# EasyEDA Pro project 底板.epro

# Schematic Schematic1
Assembly Variant: Basic; Board Name: Board1; Create Date: 2026-09-26; Page Name: P1; Project Name: 底板; Schematic Name: Schematic1; Update Date: 2026-09-26; Company: 嘉立创EDA; Page Size: A4; Version: V1.0
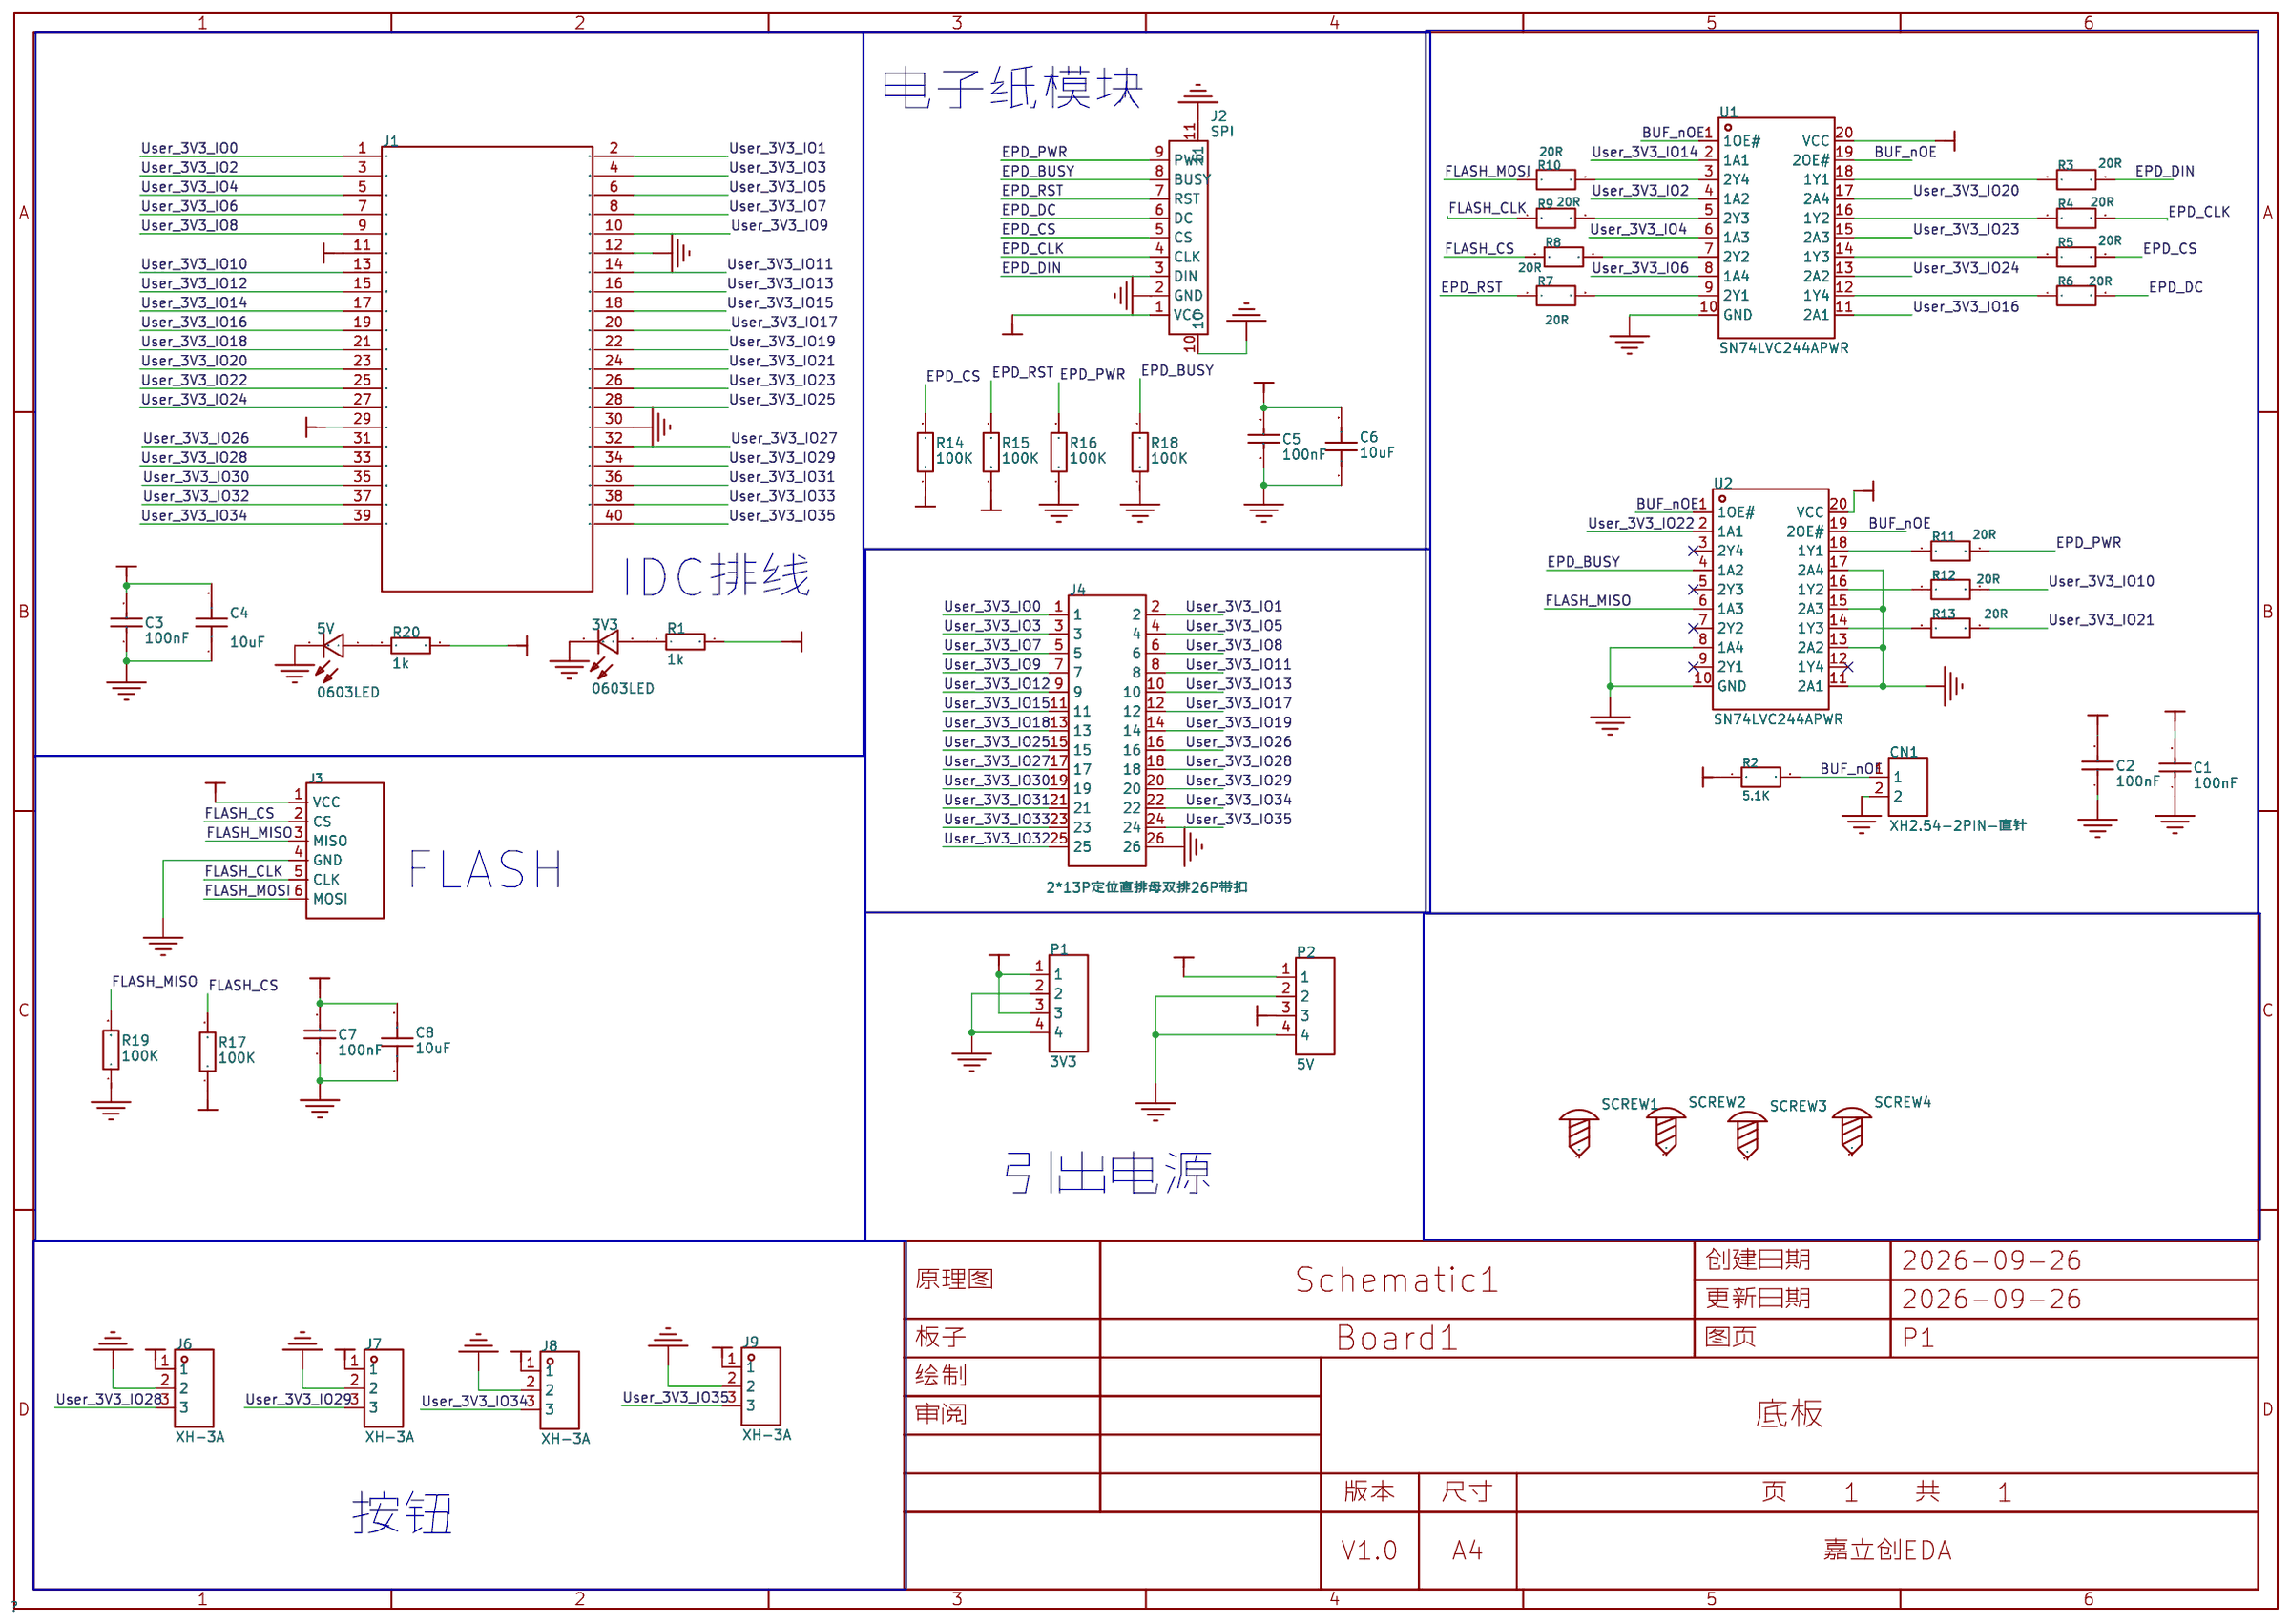
[diagram p0: schematic sheet]

## Parts
3V3  0603LED  [LED0603-R-RD_RED]
5V  0603LED  [LED0603-R-RD_RED]
C1  100nF  [C0603]
C2  100nF  [C0603]
C3  100nF  [C0603]
C4  10uF  [C0805]
C5  100nF  [C0603]
C6  10uF  [C0805]
C7  100nF  [C0603]
C8  10uF  [C0805]
CN1  XH2.54-2PIN-直针  [CONN-TH_XH2.54-2P]
J1  -  [IDC40P]
J2  SPI  [CONN-SMD_9P-P1.25_BX-GH1.25-9PWT]
J3  X4611FV-06-C63D28  [HDR-TH_6P-P2.00-V-F]
J4  2*13P定位直排母双排26P带扣  [IDC-TH_26P-P2.54-V-M-R2-C13-S2.54]
J6  XH-3A  [CONN-TH_3P-P2.50_C9900023074]
J7  XH-3A  [CONN-TH_3P-P2.50_C9900023074]
J8  XH-3A  [CONN-TH_3P-P2.50_C9900023074]
J9  XH-3A  [CONN-TH_3P-P2.50_C9900023074]
P1  3V3  [CONN-TH_4P-P2.50-XH2.54-4P]
P2  5V  [CONN-TH_4P-P2.50-XH2.54-4P]
R1  1k  [R0603]
R2  5.1K  [R0603]
R3  20R  [R0603]
R4  20R  [R0603]
R5  20R  [R0603]
R6  20R  [R0603]
R7  20R  [R0603]
R8  20R  [R0603]
R9  20R  [R0603]
R10  20R  [R0603]
R11  20R  [R0603]
R12  20R  [R0603]
R13  20R  [R0603]
R14  100K  [R0805]
R15  100K  [R0805]
R16  100K  [R0805]
R17  100K  [R0805]
R18  100K  [R0805]
R19  100K  [R0805]
R20  1k  [R0603]
SCREW1  -  [M3螺丝]
SCREW2  -  [M3螺丝]
SCREW3  -  [M3螺丝]
SCREW4  -  [M3螺丝]
U1  SN74LVC244APWR  [TSSOP-20_L6.5-W4.4-P0.65-LS6.4-BL]
U2  SN74LVC244APWR  [TSSOP-20_L6.5-W4.4-P0.65-LS6.4-BL]

## Library data of the parts
3V3 5V = 0603LED: Supplier Part: C9900009051; Supplier Footprint: LED-RED-0603; JLCPCB Part Class: Extended Part; Supplier: LCSC
C1-C3 C5 C7 = CL10A225KO8NNNC: 容值:2.2uF;精度:±10%;额定电压:16V;温度系数:X5R;; LCSC Part Name: 2.2uF ±10% 16V; Supplier Part: C23630; Manufacturer: SAMSUNG(三星); Supplier Footprint: 0603; JLCPCB Part Class: Basic Part; Datasheet: https://item.szlcsc.com/datasheet/CL10A225KO8NNNC/24366.html; Supplier: LCSC; Tolerance: ±10%; Voltage Rating: 16V; Temperature Coefficient: X5R
C4 C6 C8 = GRM21BR61H106KE43L: 容值:10uF;精度:±10%;额定电压:50V;温度系数:X5R;; LCSC Part Name: 10uF ±10% 50V; Supplier Part: C440198; Manufacturer: muRata(村田); Supplier Footprint: 0805; JLCPCB Part Class: Basic Part; Datasheet: https://item.szlcsc.com/datasheet/GRM21BR61H106KE43L/439567.html; Supplier: LCSC; Tolerance: ±10%; Voltage Rating: 50V; Temperature Coefficient: X5R
CN1 = XH2.54-2PIN-直针: Supplier Part: C9900011425; Supplier Footprint: XH2.54-2PIN; JLCPCB Part Class: Extended Part; Supplier: LCSC
J1 = iDC40P
J2 = BX-GH1.25-9PWT: 插针结构:1x9P;间距:1.25mm;安装方式:卧贴;参考系列:GH;总PIN数:9P;排数:1;每排PIN数:9;行距:-;额定电流:1A;触头材质:磷铜;触头镀层:锡;工作温度:-25℃~+85℃;; LCSC Part Name: 1x9P 间距:1.25mm 卧贴 系列:GH; Supplier Part: C18077725; Manufacturer: Bossie(博锡); Supplier Footprint: SMD,P=1.25mm,卧贴; JLCPCB Part Class: Extended Part; Datasheet: https://item.szlcsc.com/datasheet/BX-GH1.25-9PWT/19218126.html; Supplier: LCSC; Pins Structure: 1x9P; Pitch: 1.25mm; Mounting Type: 卧贴; Reference Series: GH; Number of Pins: 9P; Number of Rows: 1; Number of PINs Per Row: 9; Current Rating: 1A; Contact Material: 磷铜; Contact Plating: 锡; Operating Temperature: -25℃~+85℃; Voltage Rating: 125V; Plastic Material: LCP; Supplementary Features: 辅助焊脚; Color: 米色; Z-Height of the Board: 4.35mm; X-Length of Bottom Edge on Board (Spacing Line): 14.5mm; Y-Width of Bottom Edge on Board: 5mm
J3 = X4611FV-06-C63D28: LCSC Part Name: 2.0mm 排母,单排,180度,塑高6.3mm,塑宽2.4mm,下针D2.8mm,U型,6T料,镀金,06P; Supplier Part: C56147503; Manufacturer: XKB Connection(中国星坤); Supplier Footprint: 插件,P=2mm; JLCPCB Part Class: Extended Part; Datasheet: https://item.szlcsc.com/datasheet/X4611FV-06-C63D28/60366544.html; Supplier: LCSC
J4 = 2*13P定位直排母双排26P带扣: Supplier Part: C9900004837; Supplier Footprint: 插件; JLCPCB Part Class: Extended Part; Supplier: LCSC
J6-J9 = XH-3A_C9900023074: Supplier Part: C9900023074; Supplier Footprint: XH2.54-3P; JLCPCB Part Class: Extended Part; Supplier: LCSC
P1 P2 = XH2.54-4P_C9900003326: LCSC Part Name: XH2.54-4P; Supplier Part: C9900003326; JLCPCB Part Class: Extended Part; Supplier: LCSC
R1 R20 = 0603WAF3301T5E: 电阻类型:厚膜电阻;阻值:3.3kΩ;精度:±1%;功率:100mW;工作电压:75V;温度系数:±100ppm/℃;; LCSC Part Name: 3.3kΩ ±1% 100mW 厚膜电阻; Supplier Part: C22978; Manufacturer: UNI-ROYAL(厚声); Supplier Footprint: 0603; JLCPCB Part Class: Basic Part; Datasheet: https://item.szlcsc.com/datasheet/0603WAF3301T5E/23705.html; Supplier: LCSC; Type: 厚膜电阻; Tolerance: ±1%; Power(Watts): 100mW; Voltage-Supply(Max): 75V; Temperature Coefficient: ±100ppm/℃; Operating Temperature: -55℃~+155℃
R2-R13 = FRQ0603F1302TS: 电阻类型:厚膜电阻;阻值:13kΩ;精度:±1%;功率:100mW;工作电压:75V;温度系数:±100ppm/℃;; LCSC Part Name: 厚膜电阻 13kΩ ±1% 100mW; Supplier Part: C42372214; Manufacturer: FOJAN(富捷); Supplier Footprint: 0603; Datasheet: https://item.szlcsc.com/datasheet/FRQ0603F1302TS/44254394.html; Supplier: LCSC; Type: 厚膜电阻; Tolerance: ±1%; Power(Watts): 100mW; Voltage-Supply(Max): 75V; Temperature Coefficient: ±100ppm/℃; Operating Temperature: -55℃~+155℃
R14-R19 = 0805W8F3302T5E: 电阻类型:厚膜电阻;阻值:33kΩ;精度:±1%;功率:125mW;工作电压:150V;温度系数:±100ppm/℃;; LCSC Part Name: 厚膜电阻 33kΩ ±1%; Supplier Part: C17633; Manufacturer: UNI-ROYAL(厚声); Supplier Footprint: 0805; JLCPCB Part Class: Basic Part; Datasheet: https://item.szlcsc.com/datasheet/0805W8F3302T5E/18321.html; Supplier: LCSC; Type: 厚膜电阻; Tolerance: ±1%; Power(Watts): 125mW; Voltage-Supply(Max): 150V; Temperature Coefficient: ±100ppm/℃; Operating Temperature: -55℃~+155℃
SCREW1-SCREW4 = M3螺丝: Supplier Footprint: 插件
U1 U2 = SN74LVC244APWR: 输入类型:-;工作电压:1.65V~3.6V;元件数:2;每个元件位数:4;灌电流(IOL):24mA;拉电流(IOH):24mA;; LCSC Part Name: 三态输出，八路缓冲器/驱动器; Supplier Part: C7668; Manufacturer: TI(德州仪器); Supplier Footprint: TSSOP-20; JLCPCB Part Class: Extended Part; Datasheet: https://www.ti.com/cn/lit/ds/symlink/sn74lvc244a.pdf; Supplier: LCSC; output type: 三态; Voltage - Supply: 1.65V~3.6V; Number of Elements: 2; Number of Bits per Element: 4; Channel Type: 单向; Current - Output Low(IOL): 24mA; Current - Output High(IOH): 24mA; Logic Family: 74LVC; Operating Temperature: -40℃~+125℃; Quiescent Current: 40uA; Propagation Delay: 3.9ns@3.3V,50pF; Features: 掉电隔离；输出使能；电平转换

## Nets
3V3: C1.2 C2.2 C3.2 C4.2 C5.2 C6.2 C7.2 C8.2 J1.29(15) J2.1(VCC) J3.1(VCC) J6.1 J7.1 J8.1 J9.1 P1.1 P1.3 R1.2 R2.1 R14.1 R15.1 R17.1 U1.20(VCC) U2.20(VCC)
5V: J1.11(6) R20.2
GND: 3V3.2(C) 5V.2(C) C1.1 C2.1 C3.1 C4.1 C5.1 C6.1 C7.1 C8.1 CN1.2 J1.12(26) J1.30(35) J2.2(GND) J2.10 J2.11 J3.4(GND) J4.26 J6.2 J7.2 J8.2 J9.2 P1.2 P1.4 P2.2 R16.1 R18.1 R19.1 U1.10(GND) U2.8(1A4) U2.10(GND) U2.11(2A1) U2.13(2A2) U2.15(2A3) U2.17(2A4)
BUF_nOE: CN1.1 R2.2 U1.1(1OE#) U1.19(2OE#) U2.1(1OE#) U2.19(2OE#)
EPD_BUSY: J2.8(BUSY) R18.2 U2.4(1A2)
EPD_CLK: J2.4(CLK) R4.2
EPD_CS: J2.5(CS) R5.2 R14.2
EPD_DC: J2.6(DC) R6.2
EPD_DIN: J2.3(DIN) R3.2
EPD_PWR: J2.9(PWR) R11.2 R16.2
EPD_RST: J2.7(RST) R7.1 R15.2
FLASH_CLK: J3.5(CLK) R9.1
FLASH_CS: J3.2(CS) R8.1 R17.2
FLASH_MISO: J3.3(MISO) R19.2 U2.6(1A3)
FLASH_MOSI: J3.6(MOSI) R10.1
User_3V3_IO0: J1.1 J4.1
User_3V3_IO1: J1.2(21) J4.2
User_3V3_IO2: J1.3(2) U1.4(1A2)
User_3V3_IO3: J1.4(22) J4.3
User_3V3_IO4: J1.5(3) U1.6(1A3)
User_3V3_IO5: J1.6(23) J4.4
User_3V3_IO6: J1.7(4) U1.8(1A4)
User_3V3_IO7: J1.8(24) J4.5
User_3V3_IO8: J1.9(5) J4.6
User_3V3_IO9: J1.10(25) J4.7
User_3V3_IO10: J1.13(7) R12.2
User_3V3_IO11: J1.14(27) J4.8
User_3V3_IO12: J1.15(8) J4.9
User_3V3_IO13: J1.16(28) J4.10
User_3V3_IO14: J1.17(9) U1.2(1A1)
User_3V3_IO15: J1.18(29) J4.11
User_3V3_IO16: J1.19(10) U1.11(2A1)
User_3V3_IO17: J1.20(30) J4.12
User_3V3_IO18: J1.21(11) J4.13
User_3V3_IO19: J1.22(31) J4.14
User_3V3_IO20: J1.23(12) U1.17(2A4)
User_3V3_IO21: J1.24(32) R13.2
User_3V3_IO22: J1.25(13) U2.2(1A1)
User_3V3_IO23: J1.26(33) U1.15(2A3)
User_3V3_IO24: J1.27(14) U1.13(2A2)
User_3V3_IO25: J1.28(34) J4.15
User_3V3_IO26: J1.31(16) J4.16
User_3V3_IO27: J1.32(36) J4.17
User_3V3_IO28: J1.33(17) J4.18 J6.3
User_3V3_IO29: J1.34(37) J4.20 J7.3
User_3V3_IO30: J1.35(18) J4.19
User_3V3_IO31: J1.36(38) J4.21
User_3V3_IO32: J1.37(19) J4.25
User_3V3_IO33: J1.38(39) J4.23
User_3V3_IO34: J1.39(20) J4.22 J8.3
User_3V3_IO35: J1.40 J4.24 J9.3
$1N39: 3V3.1(A) R1.1
$1N100: R3.1 U1.18(1Y1)
$1N110: R12.1 U2.16(1Y2)
$1N121: R13.1 U2.14(1Y3)
$1N148: R11.1 U2.18(1Y1)
$1N153: R9.2 U1.5(2Y3)
$1N155: R5.1 U1.14(1Y3)
$1N157: R6.1 U1.12(1Y4)
$1N159: R4.1 U1.16(1Y2)
$1N162: R7.2 U1.9(2Y1)
$1N164: R8.2 U1.7(2Y2)
$1N165: R10.2 U1.3(2Y4)
$1N253: 5V.1(A) R20.1

Not connected (* = marked no-connect by the designer): P2 1 3 4; SCREW1 1; SCREW2 1; SCREW3 1; SCREW4 1; U2 3(2Y4)* 5(2Y3)* 7(2Y2)* 9(2Y1)* 12(1Y4)*

## Notes on the sheet
- 电子纸模块
- IDC排线
- FLASH
- 引出电源
- 按钮

# Board PCB1
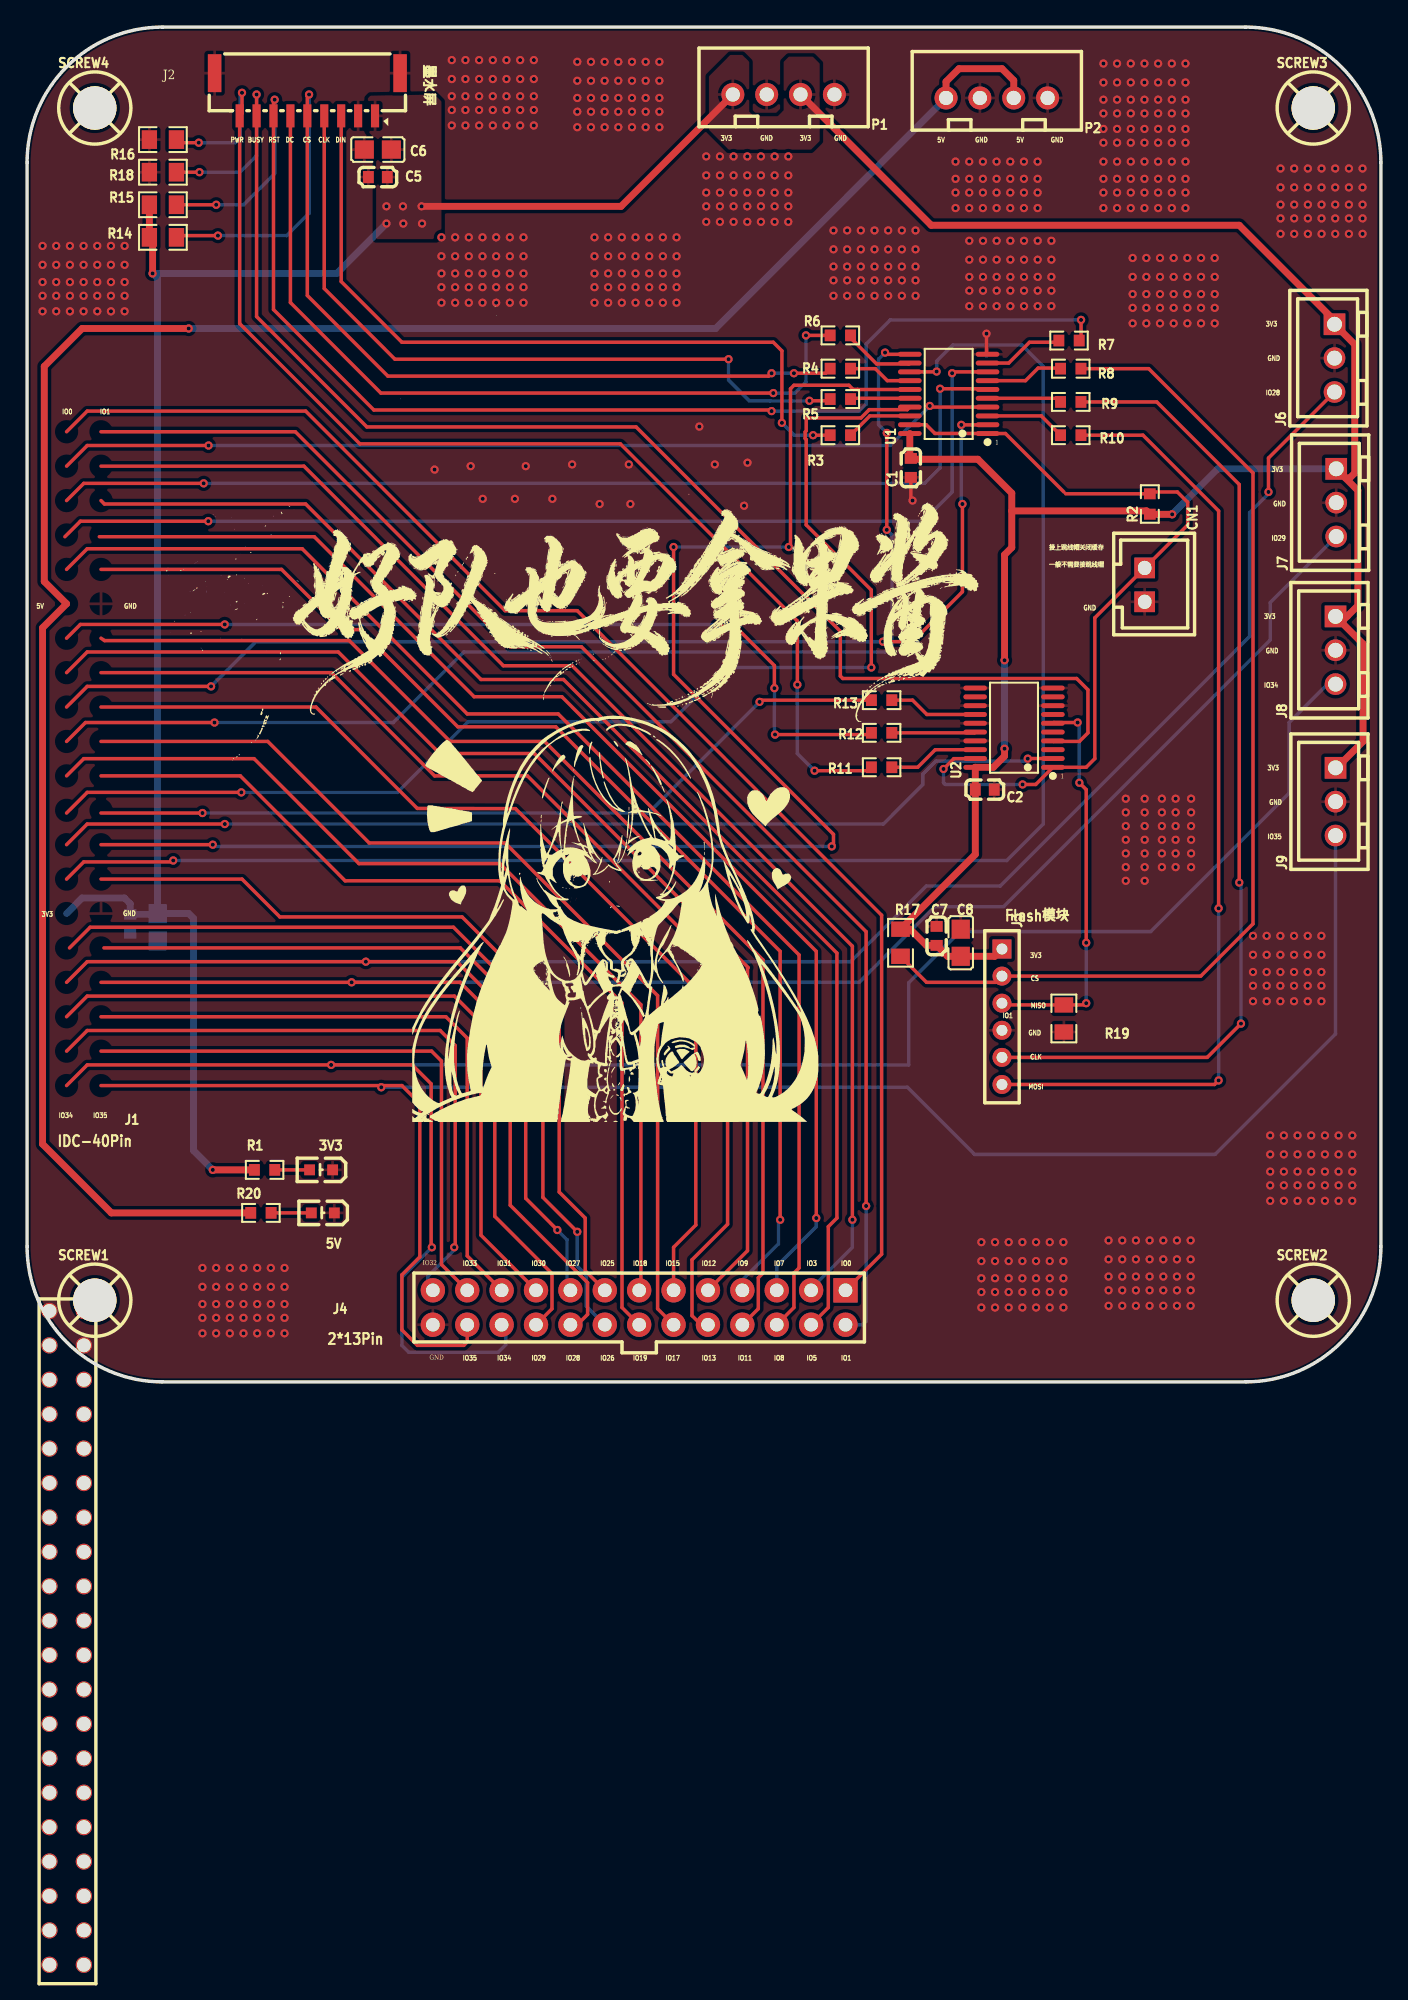
[diagram p1: board, top side]
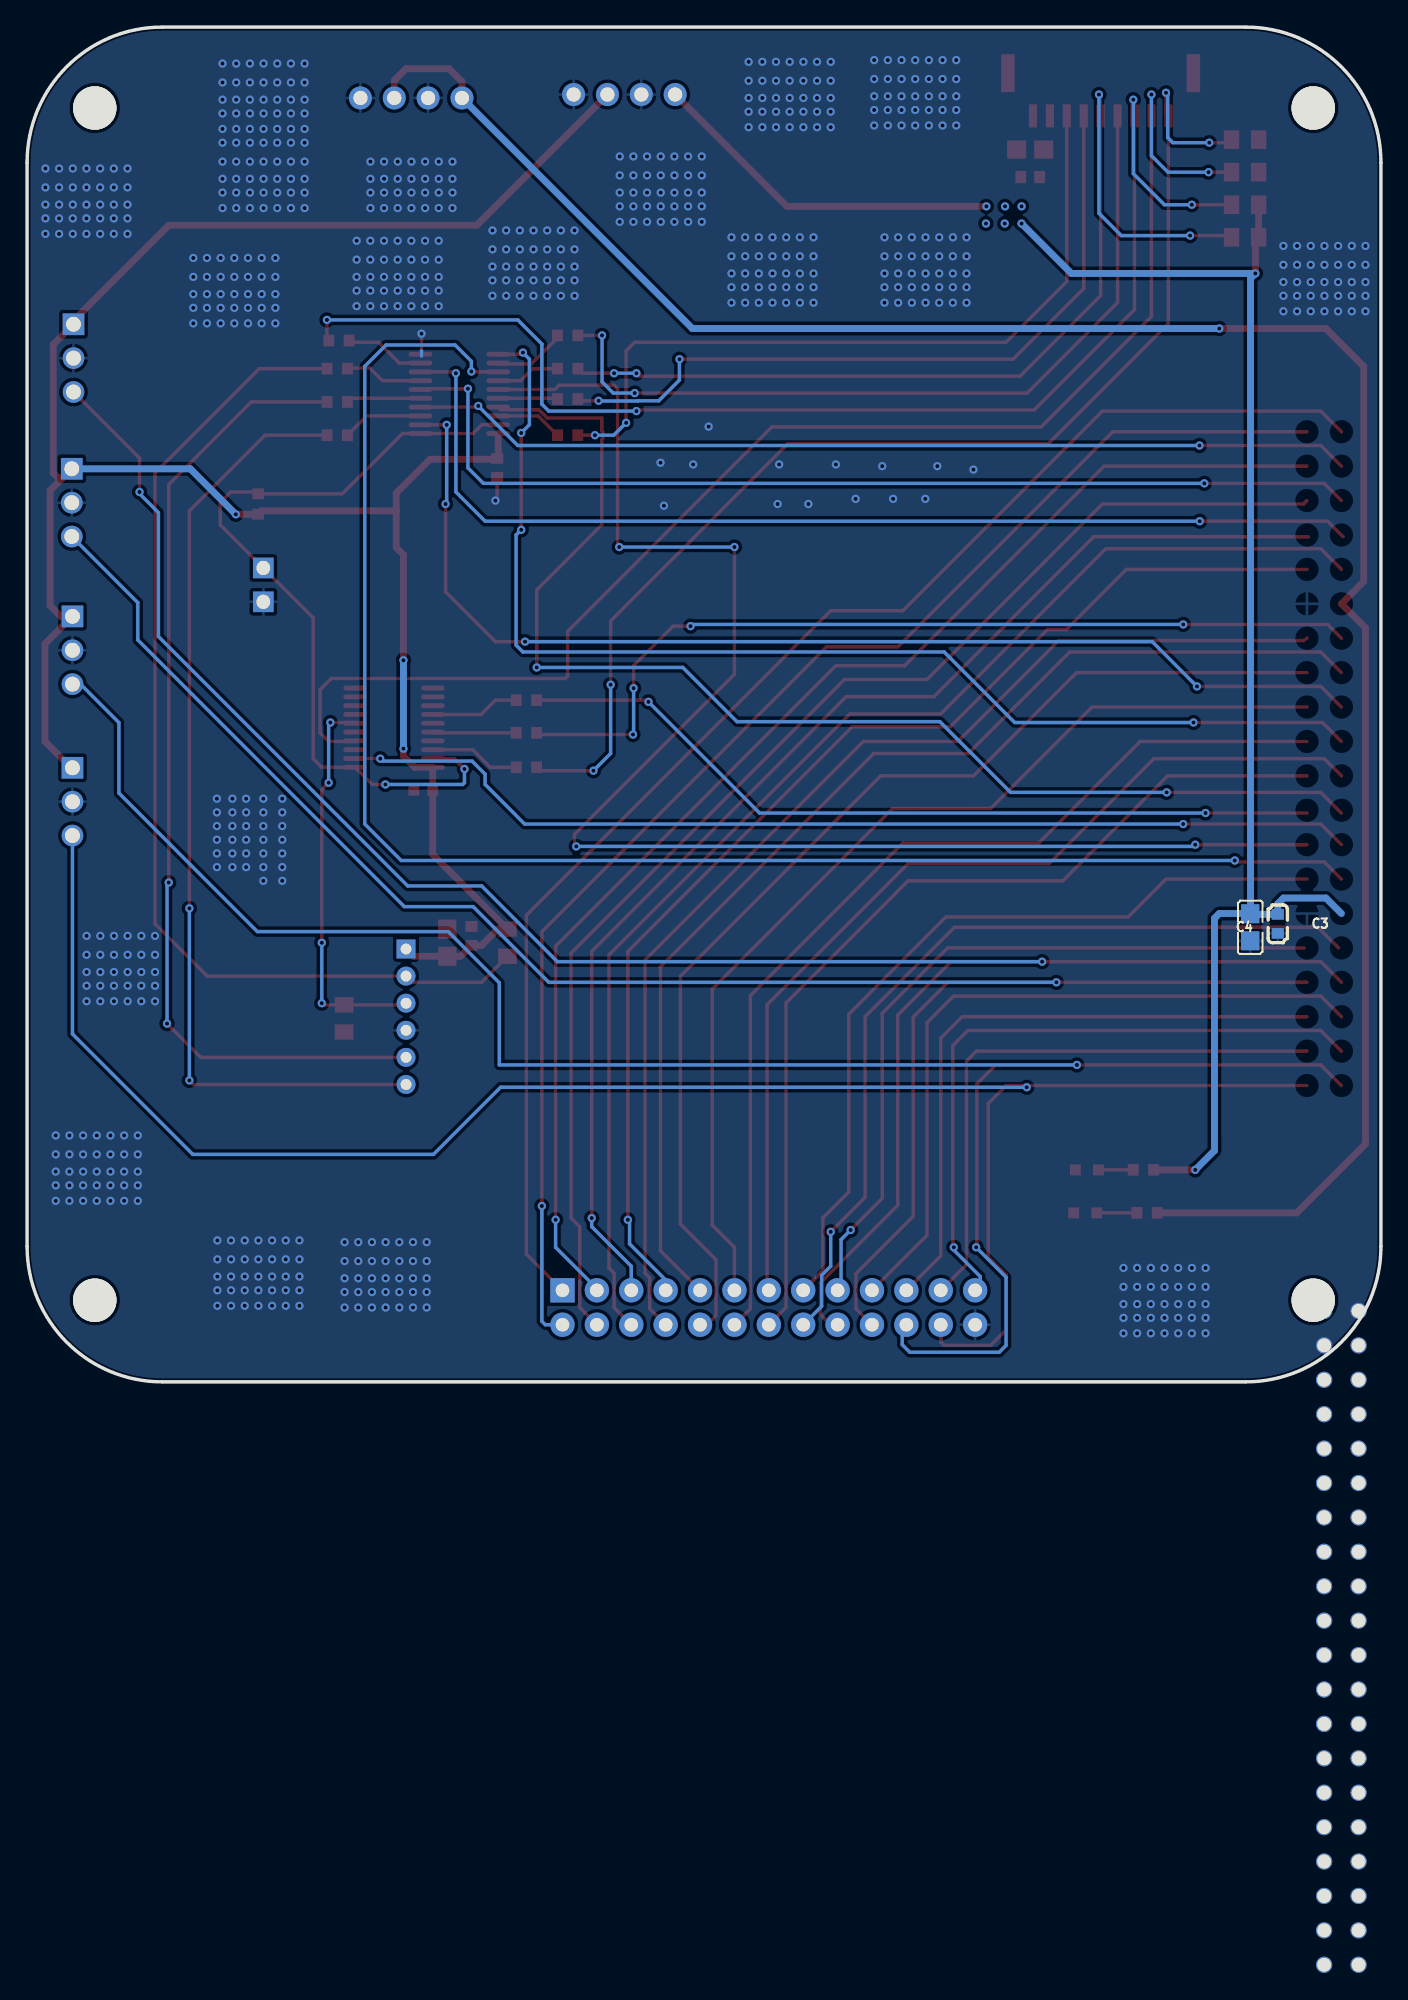
[diagram p2: board, bottom side, seen from below]

Outline 100 x 100 mm; copper layers: Top Layer, Bottom Layer. Coordinates in mm from the lower left corner of the outline.
Outline path: 0,90 0,10 arc(2.93,2.93) 10,0 90,0 arc(97.07,2.93) 100,10 100,90 arc(97.07,97.07) 90,100 10,100 arc(2.93,97.07) 0,90
Stack: Top Layer 0.035mm / Dielectric1 1.51mm FR4 er 4.5 / Bottom Layer 0.035mm

## Design rules (mm)
spacing copperThickness1oz (default): track to track 0.102, other pairs 0.152 to 0.3
spacing copperThickness2oz: track to track 0.203, other pairs 0.152 to 0.3
track width copperThickness1oz (default): min 0.127, default 0.254, max 2.54
track width copperThickness2oz: min 0.203, default 0.254, max 2.54
track width power: min 0.127, default 0.508, max 2.54
differential pair differentialPair (default): width min 0.127, default 0.254, max 2.54; gap min 0.152, default 0.152
net 3V3 uses copperRegion, power
net 5V uses power
net GND uses copperRegion

## Placement (name value [footprint] x y rotation side)
3V3  0603LED  [LED0603-R-RD_RED]  21.72 15.65 180 top
5V  0603LED  [LED0603-R-RD_RED]  21.84 12.47 180 top
C1  100nF  [C0603]  65.28 67.46 90 top
C2  100nF  [C0603]  70.74 43.72 180 top
C3  100nF  [C0603]  7.62 33.81 90 bottom
C4  10uF  [C0805]  9.65 33.56 90 bottom
C5  100nF  [C0603]  25.91 88.93 0 top
C6  10uF  [C0805]  25.91 90.96 0 top
C7  100nF  [C0603]  67.18 32.92 270 top
C8  10uF  [C0805]  68.96 32.41 270 top
CN1  XH2.54-2PIN-直针  [CONN-TH_XH2.54-2P]  82.55 58.83 270 top
J1  -  [IDC40P]  1.65 47.27 270 top
J2  SPI  [CONN-SMD_9P-P1.25_BX-GH1.25-9PWT]  20.7 95.02 180 top
J3  X4611FV-06-C63D28  [HDR-TH_6P-P2.00-V-F]  72.01 26.95 270 top
J4  2*13P定位直排母双排26P带扣  [IDC-TH_26P-P2.54-V-M-R2-C13-S2.54]  45.21 5.49 0 top
J6  XH-3A  [CONN-TH_3P-P2.50_C9900023074]  96.57 75.56 90 top
J7  XH-3A  [CONN-TH_3P-P2.50_C9900023074]  96.7 64.9 90 top
J8  XH-3A  [CONN-TH_3P-P2.50_C9900023074]  96.65 54 90 top
J9  XH-3A  [CONN-TH_3P-P2.50_C9900023074]  96.65 42.83 90 top
P1  3V3  [CONN-TH_4P-P2.50-XH2.54-4P]  55.88 95.02 180 top
P2  5V  [CONN-TH_4P-P2.50-XH2.54-4P]  71.63 94.77 180 top
R1  1k  [R0603]  17.54 15.65 180 top
R2  5.1K  [R0603]  82.93 64.8 90 top
R3  20R  [R0603]  60.07 69.88 180 top
R4  20R  [R0603]  60.07 72.54 180 top
R5  20R  [R0603]  60.07 74.79 180 top
R6  20R  [R0603]  60.07 77.24 180 top
R7  20R  [R0603]  76.96 76.86 180 top
R8  20R  [R0603]  77.09 74.79 180 top
R9  20R  [R0603]  77.09 72.33 180 top
R10  20R  [R0603]  77.09 69.88 180 top
R11  20R  [R0603]  63.12 45.37 180 top
R12  20R  [R0603]  63.12 47.91 180 top
R13  20R  [R0603]  63.12 50.32 180 top
R14  100K  [R0805]  10.03 84.48 0 top
R15  100K  [R0805]  10.03 86.89 0 top
R16  100K  [R0805]  10.03 91.69 0 top
R17  100K  [R0805]  64.52 32.41 270 top
R18  100K  [R0805]  10.03 89.29 0 top
R19  100K  [R0805]  76.58 26.82 90 top
R20  1k  [R0603]  17.27 12.47 180 top
SCREW1  -  [M3螺丝]  5 6.03 0 top
SCREW2  -  [M3螺丝]  95 6.03 0 top
SCREW3  -  [M3螺丝]  95 94.03 0 top
SCREW4  -  [M3螺丝]  5 94.03 0 top
U1  SN74LVC244APWR  [TSSOP-20_L6.5-W4.4-P0.65-LS6.4-BL]  68.07 72.93 90 top
U2  SN74LVC244APWR  [TSSOP-20_L6.5-W4.4-P0.65-LS6.4-BL]  72.9 48.29 90 top

## Footprints (pads in the part's own frame, mm; a bottom-side part is the same pattern mirrored in y, then rotated)
C0603
  rect 0.8x0.9 smd: 1(-0.7,0) 2(0.7,0)
C0805
  rect 1.41x1.35 smd: 1(-1,0) 2(1,0)
CONN-SMD_9P-P1.25_BX-GH1.25-9PWT
  rect 0.6x1.7 smd: 1(-5,1.575) 2(-3.75,1.575) 3(-2.5,1.575) 4(-1.25,1.575) 5(0,1.575) 6(1.25,1.575) 7(2.5,1.575) 8(3.75,1.575) 9(5,1.575)
  rect 1x2.8 smd: 10(6.85,-1.575) 11(-6.85,-1.575)
CONN-TH_3P-P2.50_C9900023074
  rect 1.6x1.6 hole 1.1: 1(2.5,0)
  round 1.6 hole 1.1: 2(0.001,0) 3(-2.5,0)
CONN-TH_4P-P2.50-XH2.54-4P
  round 1.7 hole 1.05: 1(3.75,0) 2(1.25,0) 3(-1.25,0) 4(-3.75,0)
CONN-TH_XH2.54-2P
  rect 1.524x1.524 hole 1.05x1: 1(-1.25,0) 2(1.25,0)
HDR-TH_6P-P2.00-V-F
  rect 1.4x1.4 hole 0.8: 1(-5,0)
  round 1.4 hole 0.8: 2(-3,0) 3(-1,0) 4(1,0) 5(3,0) 6(5,0)
IDC40P
  round 1.2 hole 1.02: 1(42.037,0) 2(42.037,2.544) 3(44.577,0) 4(44.577,2.544) 5(47.117,0) 6(47.117,2.544) 7(49.657,0) 8(49.657,2.544) 9(52.197,0) 10(52.197,2.544) 11(54.737,0) 12(54.737,2.544) 13(57.277,0) 14(57.277,2.544) 15(59.817,0) 16(59.817,2.544) 17(62.357,0) 18(62.357,2.544) 19(64.897,0) 20(64.897,2.544) 21(67.437,0) 22(67.437,2.544) 23(69.977,0) 24(69.977,2.544) 25(72.517,0) 26(72.517,2.544) 27(75.057,0) 28(75.057,2.544) 29(77.597,0) 30(77.597,2.544) 31(80.137,0) 32(80.137,2.544) 33(82.677,0) 34(82.677,2.544) 35(85.217,0) 36(85.217,2.544) 37(87.757,0) 38(87.757,2.544) 39(90.297,0) 40(90.297,2.544)
IDC-TH_26P-P2.54-V-M-R2-C13-S2.54
  rect 1.8x1.8 hole 1.005x1: 1(15.24,1.27)
  round 1.8 hole 1.005x1: 2(15.24,-1.27) 3(12.7,1.27) 4(12.7,-1.27) 5(10.16,1.27) 6(10.16,-1.27) 7(7.62,1.27) 8(7.62,-1.27) 9(5.08,1.27) 10(5.08,-1.27) 11(2.54,1.27) 12(2.54,-1.27) 13(0,1.27) 14(0,-1.27) 15(-2.54,1.27) 16(-2.54,-1.27) 17(-5.08,1.27) 18(-5.08,-1.27) 19(-7.62,1.27) 20(-7.62,-1.27) 21(-10.16,1.27) 22(-10.16,-1.27) 23(-12.7,1.27) 24(-12.7,-1.27) 25(-15.24,1.27) 26(-15.24,-1.27)
LED0603-R-RD_RED
  rect 0.8x0.8 smd: 1(0.851,0) 2(-0.851,0)
M3螺丝
  round 3.2 hole 3.2: 1(0,0)
R0603
  rect 0.806x0.864 smd: 1(-0.753,0) 2(0.753,0)
R0805
  rect 1.133x1.377 smd: 1(-1,0) 2(1,0)
TSSOP-20_L6.5-W4.4-P0.65-LS6.4-BL
  oval 0.364x1.742 smd: 1(-2.925,-2.871) 2(-2.275,-2.871) 3(-1.625,-2.871) 4(-0.975,-2.871) 5(-0.325,-2.871) 6(0.325,-2.871) 7(0.975,-2.871) 8(1.625,-2.871) 9(2.275,-2.871) 10(2.925,-2.871) 11(2.925,2.871) 12(2.275,2.871) 13(1.625,2.871) 14(0.975,2.871) 15(0.325,2.871) 16(-0.325,2.871) 17(-0.975,2.871) 18(-1.625,2.871) 19(-2.275,2.871) 20(-2.925,2.871)

## Nets
As in the schematic, except:
5V: J1.11 P2.1 P2.3 R20.2
GND: 3V3.2 5V.2 C1.1 C2.1 C3.1 C4.1 C5.1 C6.1 C7.1 C8.1 CN1.2 J1.12 J1.30 J2.2 J2.10 J2.11 J3.4 J4.26 J6.2 J7.2 J8.2 J9.2 P1.2 P1.4 P2.2 P2.4 R16.1 R18.1 R19.1 U1.10 U2.8 U2.10 U2.11 U2.13 U2.15 U2.17

Pads without a net: SCREW1 1; SCREW2 1; SCREW3 1; SCREW4 1; U2 3 5 7 9 12

## Via types
v1: diameter 0.61, hole 0.305, Top Layer to Bottom Layer, 751 vias

## Routing (per net, layer and track width the routed paths; a pad name or vN(x,y) marks a point on that pad's centre or on a via; arc(x,y) is an arc through that point)
3V3: length 295.2
  Top Layer w0.508: 72.73,64.29 72.73,61.58 72.2,61.05 v1(72.2,53.26) ; 72.73,64.29 82.69,64.29 R2.1 82.94,64.04 v1(84.58,64.04) ; 72.73,64.29 72.73,65.6 70.23,68.1 65.34,68.1 C1.2 65.2,68.24 65.2,70 ; J3.1 71.47,31.41 C8.2 67.99,31.41 C7.2 66.43,32.22 65.24,33.41 R17.1 70.04,38.94 C2.2 70.04,45.35 U2.20 71.37,45.36 72.2,46.19 v1(72.2,46.74) ; P1.1 43.88,86.77 v1(29.14,86.77) ; R15.1 R14.1 9.27,84.24 v1(9.27,81.82) ; P1.3 66.78,85.37 89.54,85.37 96.57,78.34 J6.1 98.07,76.57 98.07,67.08 97.71,66.72 97.37,66.72 98.3,65.8 98.3,57.3 97.52,56.52 97.51,56.52 97.07,56.08 ; 97.07,56.08 98.68,54.47 98.68,47.27 96.73,45.33 J9.1 ; 97.07,56.08 J8.1 ; v1(13.72,15.65) 16.64,15.65
  Bottom Layer w0.508: J7.1 87.94,67.4 v1(84.58,64.04) ; v1(26.54,85.5) 22.86,81.82 v1(9.27,81.82) 9.63,81.46 9.63,34.58 C4.2 ; v1(72.2,53.26) v1(72.2,46.74) ; 2.92,34.57 4.06,35.71 7.2,35.71 7.62,35.29 C3.2 9.61,34.51 C4.2 ; C4.2 9.67,34.57 11.94,34.57 12.3,34.21 12.3,17.07 v1(13.72,15.65)
  vias: v1(26.54,86.77) v1(27.76,86.77) v1(27.79,85.5) v1(29.17,85.5)
5V: length 159.4
  Top Layer w0.508: v1(11.94,77.75) 4.06,77.75 1.27,74.96 1.27,59.08 2.92,57.43 1.14,55.66 1.14,17.55 6.22,12.47 R20.2 ; P2.3 72.88,96.06 72.01,96.93 68.83,96.93 67.88,95.97 P2.1
  Bottom Layer w0.508: v1(11.94,77.75) 50.86,77.75 P2.1
GND: length 3.7
  Top Layer w0.254: 70.87,75.85 v1(70.87,77.37) ; C1.1 65.28,65.18 v1(65.41,65.05)
  Bottom Layer w0.254: 70.87,75.72 70.87,76.1
  vias: v1(1.14,83.85) v1(1.14,82.45) v1(1.14,81.18) v1(1.14,80.16) v1(1.14,79.02) v1(2.15,83.85) v1(2.15,82.45) v1(2.15,81.18) v1(2.15,80.16) v1(2.15,79.02) v1(3.16,83.85) v1(3.16,82.45) v1(3.16,81.18) v1(3.16,80.16) v1(3.16,79.02) v1(4.17,83.85) v1(4.17,82.45) v1(4.17,81.18) v1(4.17,80.16) v1(4.17,79.02) v1(5.18,83.85) v1(5.18,82.45) v1(5.18,81.18) v1(5.18,80.16) v1(5.18,79.02) v1(6.19,83.85) v1(6.19,82.45) v1(6.19,81.18) v1(6.19,80.16) v1(6.19,79.02) v1(7.2,83.85) v1(7.2,82.45) v1(7.2,81.18) v1(7.2,80.16) v1(7.2,79.02) v1(12.95,8.41) v1(12.95,7.01) v1(12.95,5.74) v1(12.95,4.73) v1(12.95,3.58) v1(13.97,8.41) v1(13.97,7.01) v1(13.97,5.74) v1(13.97,4.73) v1(13.97,3.58) v1(14.97,8.41) v1(14.97,7.01) v1(14.97,5.74) v1(14.97,4.73) v1(14.97,3.58) v1(15.99,8.41) v1(15.99,7.01) v1(15.99,5.74) v1(15.99,4.73) v1(15.99,3.58) v1(17,8.41) v1(17,7.01) v1(17,5.74) v1(17,4.73) v1(17,3.58) v1(18.01,8.41) v1(18.01,7.01) v1(18.01,5.74) v1(18.01,4.73) v1(18.01,3.58) v1(19.02,8.41) v1(19.02,7.01) v1(19.02,5.74) v1(19.02,4.73) v1(19.02,3.58) v1(30.1,67.34) v1(30.61,84.48) v1(30.61,83.09) v1(30.61,81.82) v1(30.61,80.8) v1(30.61,79.66) v1(31.37,97.56) v1(31.37,96.17) v1(31.37,94.9) v1(31.37,93.88) v1(31.37,92.74) v1(31.62,84.48) v1(31.62,83.09) v1(31.62,81.82) v1(31.62,80.8) v1(31.62,79.66) v1(32.38,97.56) v1(32.38,96.17) v1(32.38,94.9) v1(32.38,93.88) v1(32.38,92.74) v1(32.63,84.48) v1(32.63,83.09) v1(32.63,81.82) v1(32.63,80.8) v1(32.63,79.66) v1(32.77,67.59) v1(33.39,97.56) v1(33.39,96.17) v1(33.39,94.9) v1(33.39,93.88) v1(33.39,92.74) v1(33.64,84.48) v1(33.64,83.09) v1(33.64,81.82) v1(33.64,80.8) v1(33.64,79.66) v1(33.66,65.18) v1(34.4,97.56) v1(34.4,96.17) v1(34.4,94.9) v1(34.4,93.88) v1(34.4,92.74) v1(34.65,84.48) v1(34.65,83.09) v1(34.65,81.82) v1(34.65,80.8) v1(34.65,79.66) v1(35.41,97.56) v1(35.41,96.17) v1(35.41,94.9) v1(35.41,93.88) v1(35.41,92.74) v1(35.66,84.48) v1(35.66,83.09) v1(35.66,81.82) v1(35.66,80.8) v1(35.66,79.66) v1(36.03,65.18) v1(36.42,97.56) v1(36.42,96.17) v1(36.42,94.9) v1(36.42,93.88) v1(36.42,92.74) v1(36.67,84.48) v1(36.67,83.09) v1(36.67,81.82) v1(36.67,80.8) v1(36.67,79.66) v1(36.83,67.59) v1(37.43,97.56) v1(37.43,96.17) v1(37.43,94.9) v1(37.43,93.88) v1(37.43,92.74) v1(38.8,65.18) v1(40.26,67.72) v1(40.64,97.44) v1(40.64,96.04) v1(40.64,94.77) v1(40.64,93.75) v1(40.64,92.61) v1(41.65,97.44) v1(41.65,96.04) v1(41.65,94.77) v1(41.65,93.75) v1(41.65,92.61) v1(41.91,84.48) v1(41.91,83.09) v1(41.91,81.82) v1(41.91,80.8) v1(41.91,79.66) v1(42.29,64.8) v1(42.66,97.44) v1(42.66,96.04) v1(42.66,94.77) v1(42.66,93.75) v1(42.66,92.61) v1(42.92,84.48) v1(42.92,83.09) v1(42.92,81.82) v1(42.92,80.8) v1(42.92,79.66) v1(43.67,97.44) v1(43.67,96.04) v1(43.67,94.77) v1(43.67,93.75) v1(43.67,92.61) v1(43.93,84.48) v1(43.93,83.09) v1(43.93,81.82) v1(43.93,80.8) v1(43.93,79.66) v1(44.45,67.72) v1(44.56,64.8) v1(44.68,97.44) v1(44.68,96.04) v1(44.68,94.77) v1(44.68,93.75) v1(44.68,92.61) v1(44.94,84.48) v1(44.94,83.09) v1(44.94,81.82) v1(44.94,80.8) v1(44.94,79.66) v1(45.69,97.44) v1(45.69,96.04) v1(45.69,94.77) v1(45.69,93.75) v1(45.69,92.61) v1(45.95,84.48) v1(45.95,83.09) v1(45.95,81.82) v1(45.95,80.8) v1(45.95,79.66) v1(46.7,97.44) v1(46.7,96.04) v1(46.7,94.77) v1(46.7,93.75) v1(46.7,92.61) v1(46.96,84.48) v1(46.96,83.09) v1(46.96,81.82) v1(46.96,80.8) v1(46.96,79.66) v1(47.97,84.48) v1(47.97,83.09) v1(47.97,81.82) v1(47.97,80.8) v1(47.97,79.66) v1(49.66,70.51) v1(50.17,90.45) v1(50.17,89.05) v1(50.17,87.78) v1(50.17,86.77) v1(50.17,85.63) v1(50.8,67.72) v1(51.18,90.45) v1(51.18,89.05) v1(51.18,87.78) v1(51.18,86.77) v1(51.18,85.63) v1(52.19,90.45) v1(52.19,89.05) v1(52.19,87.78) v1(52.19,86.77) v1(52.19,85.63) v1(52.96,64.67) v1(53.2,90.45) v1(53.2,89.05) v1(53.2,87.78) v1(53.2,86.77) v1(53.2,85.63) v1(53.21,67.85) v1(54.21,90.45) v1(54.21,89.05) v1(54.21,87.78) v1(54.21,86.77) v1(54.21,85.63) v1(55.22,90.45) v1(55.22,89.05) v1(55.22,87.78) v1(55.22,86.77) v1(55.22,85.63) v1(56.23,90.45) v1(56.23,89.05) v1(56.23,87.78) v1(56.23,86.77) v1(56.23,85.63) v1(59.56,84.99) v1(59.56,83.59) v1(59.56,82.32) v1(59.56,81.31) v1(59.56,80.16) v1(60.57,84.99) v1(60.57,83.59) v1(60.57,82.32) v1(60.57,81.31) v1(60.57,80.16) v1(61.58,84.99) v1(61.58,83.59) v1(61.58,82.32) v1(61.58,81.31) v1(61.58,80.16) v1(62.59,84.99) v1(62.59,83.59) v1(62.59,82.32) v1(62.59,81.31) v1(62.59,80.16) v1(63.6,84.99) v1(63.6,83.59) v1(63.6,82.32) v1(63.6,81.31) v1(63.6,80.16) v1(64.62,84.99) v1(64.62,83.59) v1(64.62,82.32) v1(64.62,81.31) v1(64.62,80.16) v1(65.62,84.99) v1(65.62,83.59) v1(65.62,82.32) v1(65.62,81.31) v1(65.62,80.16) v1(68.58,90.07) v1(68.58,88.8) v1(68.58,87.78) v1(68.58,86.64) v1(69.59,90.07) v1(69.59,88.8) v1(69.59,87.78) v1(69.59,86.64) v1(69.6,84.23) v1(69.6,82.83) v1(69.6,81.56) v1(69.6,80.55) v1(69.6,79.4) v1(70.49,10.31) v1(70.49,8.92) v1(70.49,7.65) v1(70.49,6.63) v1(70.49,5.49) v1(70.6,90.07) v1(70.6,88.8) v1(70.6,87.78) v1(70.6,86.64) v1(70.61,84.23) v1(70.61,82.83) v1(70.61,81.56) v1(70.61,80.55) v1(70.61,79.4) v1(71.5,10.31) v1(71.5,8.92) v1(71.5,7.65) v1(71.5,6.63) v1(71.5,5.49) v1(71.61,90.07) v1(71.61,88.8) v1(71.61,87.78) v1(71.61,86.64) v1(71.62,84.23) v1(71.62,82.83) v1(71.62,81.56) v1(71.62,80.55) v1(71.62,79.4) v1(72.51,10.31) v1(72.51,8.92) v1(72.51,7.65) v1(72.51,6.63) v1(72.51,5.49) v1(72.62,90.07) v1(72.62,88.8) v1(72.62,87.78) v1(72.62,86.64) v1(72.63,84.23) v1(72.63,82.83) v1(72.63,81.56) v1(72.63,80.55) v1(72.63,79.4) v1(73.52,10.31) v1(73.52,8.92) v1(73.52,7.65) v1(73.52,6.63) v1(73.52,5.49) v1(73.63,90.07) v1(73.63,88.8) v1(73.63,87.78) v1(73.63,86.64) v1(73.64,84.23) v1(73.64,82.83) v1(73.64,81.56) v1(73.64,80.55) v1(73.64,79.4) v1(74.53,10.31) v1(74.53,8.92) v1(74.53,7.65) v1(74.53,6.63) v1(74.53,5.49) v1(74.64,90.07) v1(74.64,88.8) v1(74.64,87.78) v1(74.64,86.64) v1(74.65,84.23) v1(74.65,82.83) v1(74.65,81.56) v1(74.65,80.55) v1(74.65,79.4) v1(75.54,10.31) v1(75.54,8.92) v1(75.54,7.65) v1(75.54,6.63) v1(75.54,5.49) v1(75.66,84.23) v1(75.66,82.83) v1(75.66,81.56) v1(75.66,80.55) v1(75.66,79.4) v1(76.55,10.31) v1(76.55,8.92) v1(76.55,7.65) v1(76.55,6.63) v1(76.55,5.49) v1(79.5,97.31) v1(79.5,95.91) v1(79.5,94.64) v1(79.5,93.63) v1(79.5,92.48) v1(79.5,91.47) v1(79.5,90.07) v1(79.5,88.8) v1(79.5,87.78) v1(79.5,86.64) v1(79.88,10.44) v1(79.88,9.04) v1(79.88,7.77) v1(79.88,6.76) v1(79.88,5.62) v1(80.51,97.31) v1(80.51,95.91) v1(80.51,94.64) v1(80.51,93.63) v1(80.51,92.48) v1(80.51,91.47) v1(80.51,90.07) v1(80.51,88.8) v1(80.51,87.78) v1(80.51,86.64) v1(80.89,10.44) v1(80.89,9.04) v1(80.89,7.77) v1(80.89,6.76) v1(80.89,5.62) v1(81.15,43.05) v1(81.15,42.04) v1(81.15,41.03) v1(81.15,40.02) v1(81.15,39.01) v1(81.15,38) v1(81.15,36.98) v1(81.52,97.31) v1(81.52,95.91) v1(81.52,94.64) v1(81.52,93.63) v1(81.52,92.48) v1(81.52,91.47) v1(81.52,90.07) v1(81.52,88.8) v1(81.52,87.78) v1(81.52,86.64) v1(81.66,82.96) v1(81.66,81.56) v1(81.66,80.29) v1(81.66,79.28) v1(81.66,78.13) v1(81.9,10.44) v1(81.9,9.04) v1(81.9,7.77) v1(81.9,6.76) v1(81.9,5.62) v1(82.53,97.31) v1(82.53,95.91) v1(82.53,94.64) v1(82.53,93.63) v1(82.53,92.48) v1(82.53,91.47) v1(82.53,90.07) v1(82.53,88.8) v1(82.53,87.78) v1(82.53,86.64) v1(82.55,43.05) v1(82.55,42.04) v1(82.55,41.03) v1(82.55,40.02) v1(82.55,39.01) v1(82.55,38) v1(82.55,36.98) v1(82.67,82.96) v1(82.67,81.56) v1(82.67,80.29) v1(82.67,79.28) v1(82.67,78.13) v1(82.91,10.44) v1(82.91,9.04) v1(82.91,7.77) v1(82.91,6.76) v1(82.91,5.62) v1(83.54,97.31) v1(83.54,95.91) v1(83.54,94.64) v1(83.54,93.63) v1(83.54,92.48) v1(83.54,91.47) v1(83.54,90.07) v1(83.54,88.8) v1(83.54,87.78) v1(83.54,86.64) v1(83.68,82.96) v1(83.68,81.56) v1(83.68,80.29) v1(83.68,79.28) v1(83.68,78.13) v1(83.82,43.05) v1(83.82,42.04) v1(83.82,41.03) v1(83.82,40.02) v1(83.82,39.01) v1(83.82,38) v1(83.92,10.44) v1(83.92,9.04) v1(83.92,7.77) v1(83.92,6.76) v1(83.92,5.62) v1(84.55,97.31) v1(84.55,95.91) v1(84.55,94.64) v1(84.55,93.63) v1(84.55,92.48) v1(84.55,91.47) v1(84.55,90.07) v1(84.55,88.8) v1(84.55,87.78) v1(84.55,86.64) v1(84.69,82.96) v1(84.69,81.56) v1(84.69,80.29) v1(84.69,79.28) v1(84.69,78.13) v1(84.84,43.05) v1(84.84,42.04) v1(84.84,41.03) v1(84.84,40.02) v1(84.84,39.01) v1(84.84,38) v1(84.94,10.44) v1(84.94,9.04) v1(84.94,7.77) v1(84.94,6.76) v1(84.94,5.62) v1(85.56,97.31) v1(85.56,95.91) v1(85.56,94.64) v1(85.56,93.63) v1(85.56,92.48) v1(85.56,91.47) v1(85.56,90.07) v1(85.56,88.8) v1(85.56,87.78) v1(85.56,86.64) v1(85.7,82.96) v1(85.7,81.56) v1(85.7,80.29) v1(85.7,79.28) v1(85.7,78.13) v1(85.94,10.44) v1(85.94,9.04) v1(85.94,7.77) v1(85.94,6.76) v1(85.94,5.62) v1(85.98,43.05) v1(85.98,42.04) v1(85.98,41.03) v1(85.98,40.02) v1(85.98,39.01) v1(85.98,38) v1(86.71,82.96) v1(86.71,81.56) v1(86.71,80.29) v1(86.71,79.28) v1(86.71,78.13) v1(87.72,82.96) v1(87.72,81.56) v1(87.72,80.29) v1(87.72,79.28) v1(87.72,78.13) v1(90.55,32.92) v1(90.55,31.52) v1(90.55,30.25) v1(90.55,29.24) v1(90.55,28.09) v1(91.56,32.92) v1(91.56,31.52) v1(91.56,30.25) v1(91.56,29.24) v1(91.56,28.09) v1(91.82,18.19) v1(91.82,16.79) v1(91.82,15.52) v1(91.82,14.51) v1(91.82,13.36) v1(92.58,89.56) v1(92.58,88.17) v1(92.58,86.9) v1(92.58,85.88) v1(92.58,84.74) v1(92.57,32.92) v1(92.57,31.52) v1(92.57,30.25) v1(92.57,29.24) v1(92.57,28.09) v1(92.83,18.19) v1(92.83,16.79) v1(92.83,15.52) v1(92.83,14.51) v1(92.83,13.36) v1(93.59,89.56) v1(93.59,88.17) v1(93.59,86.9) v1(93.59,85.88) v1(93.59,84.74) v1(93.58,32.92) v1(93.58,31.52) v1(93.58,30.25) v1(93.58,29.24) v1(93.58,28.09) v1(93.84,18.19) v1(93.84,16.79) v1(93.84,15.52) v1(93.84,14.51) v1(93.84,13.36) v1(94.6,89.56) v1(94.6,88.17) v1(94.6,86.9) v1(94.6,85.88) v1(94.6,84.74) v1(94.59,32.92) v1(94.59,31.52) v1(94.59,30.25) v1(94.59,29.24) v1(94.59,28.09) v1(94.85,18.19) v1(94.85,16.79) v1(94.85,15.52) v1(94.85,14.51) v1(94.85,13.36) v1(95.61,89.56) v1(95.61,88.17) v1(95.61,86.9) v1(95.61,85.88) v1(95.61,84.74) v1(95.6,32.92) v1(95.6,31.52) v1(95.6,30.25) v1(95.6,29.24) v1(95.6,28.09) v1(95.86,18.19) v1(95.86,16.79) v1(95.86,15.52) v1(95.86,14.51) v1(95.86,13.36) v1(96.62,89.56) v1(96.62,88.17) v1(96.62,86.9) v1(96.62,85.88) v1(96.62,84.74) v1(96.87,18.19) v1(96.87,16.79) v1(96.87,15.52) v1(96.87,14.51) v1(96.87,13.36) v1(97.63,89.56) v1(97.63,88.17) v1(97.63,86.9) v1(97.63,85.88) v1(97.63,84.74) v1(97.88,18.19) v1(97.88,16.79) v1(97.88,15.52) v1(97.88,14.51) v1(97.88,13.36) v1(98.65,89.56) v1(98.65,88.17) v1(98.65,86.9) v1(98.65,85.88) v1(98.65,84.74)
BUF_NOE: length 25.2
  Top Layer w0.254: 75.77,45.36 78.23,45.36 78.87,46 78.87,56.4 ; 65.2,70.65 66.41,70.65 67.06,70 ; 70.74,70 70.74,70 70.94,70 72.27,70 76.58,65.69 ; 85.73,63.25 85.73,64.92
BUF_nOE: length 34.5
  Top Layer w0.254: 85.73,63.25 CN1.1 78.87,56.4 ; v1(67.69,45.24) 68.45,46 69.47,46 ; v1(73.53,44.1) 74.5,44.1 U2.1 ; 76.72,65.55 R2.2 ; 85.73,64.92 84.96,65.69 82.93,65.69 ; 67.06,70 70.74,70
  Bottom Layer w0.254: v1(73.53,44.1) 67.82,44.1 67.69,44.22 v1(67.69,45.24)
EPD_BUSY: length 108.1
  Top Layer w0.254: R18.2 v1(12.73,89.29) ; U2.4 75.81,47.27 77.72,47.27 78.36,47.91 78.36,51.08 77.52,51.92 60.25,51.92 60.07,52.1 60.07,55.4 44.99,70.49 25.1,70.49 16.95,78.63 J2.8 v1(16.95,95.02)
  Bottom Layer w0.254: v1(12.73,89.29) 15.73,89.29 16.95,90.51 v1(16.95,95.02)
EPD_CLK: length 54.5
  Top Layer w0.254: v1(51.81,75.49) 27.17,75.49 21.95,80.7 J2.4 ; R4.2 59.19,72.42 v1(57.79,72.42)
  Bottom Layer w0.254: v1(57.79,72.42) 57.77,72.4 54.88,72.4 54.86,72.42 53.34,72.42 51.82,73.94 51.82,75.48 v1(51.81,75.49)
EPD_CS: length 75.5
  Top Layer w0.254: R5.2 58.98,74.45 v1(56.64,74.45) ; v1(20.83,95.02) 20.7,94.9 J2.5 20.7,80.19 26.65,74.24 54.78,74.24 v1(54.99,74.45) ; R14.2 11.16,84.61 v1(14.1,84.61)
  Bottom Layer w0.254: v1(20.83,95.02) 20.83,86.26 19.18,84.61 v1(14.1,84.61) ; v1(56.64,74.45) v1(54.99,74.45)
EPD_DC: length 60.2
  Top Layer w0.254: v1(55.12,72.99) 26.13,72.99 19.45,79.67 J2.6 ; v1(57.53,77.24) R6.2
  Bottom Layer w0.254: v1(55.12,72.99) 56.7,72.99 57.53,73.81 v1(57.53,77.24)
EPD_DIN: length 56.2
  Top Layer w0.254: R3.2 v1(58.06,69.88) ; v1(55.75,70.79) 55.75,76.1 55.12,76.74 27.69,76.74 23.2,81.22 J2.3
  Bottom Layer w0.254: v1(55.75,70.79) 56.67,69.88 v1(58.06,69.88)
EPD_PWR: length 91.6
  Top Layer w0.254: v1(56.9,51.46) 56.9,56.16 43.82,69.24 24.58,69.24 15.7,78.11 J2.9 15.88,93.62 v1(15.88,95.15) ; v1(58.17,45.11) 62.11,45.11 R11.2 ; R16.2 11.26,91.47 v1(12.68,91.47)
  Bottom Layer w0.254: v1(58.17,45.11) 56.9,46.38 v1(56.9,51.46) ; v1(12.68,91.47) 15.37,91.47 15.75,91.85 15.75,95.02 v1(15.88,95.15)
EPD_RST: length 98.9
  Top Layer w0.254: R15.2 v1(13.97,86.89) ; v1(18.29,94.64) 18.2,94.56 J2.7 18.2,79.15 25.62,71.74 54.91,71.74 v1(54.99,71.66) ; R7.1 77.85,77 v1(77.85,78.39)
  Bottom Layer w0.254: v1(18.29,94.64) 18.29,89.18 15.99,86.89 v1(13.97,86.89) ; v1(54.99,71.66) 61.47,71.66 61.98,72.16 61.98,76.61 63.75,78.39 v1(77.85,78.39)
FLASH_CLK: length 72.7
  Top Layer w0.254: J3.5 87.17,23.95 v1(89.66,26.44) ; v1(89.54,36.86) 89.54,66.24 83.44,72.33 R9.1
  Bottom Layer w0.254: v1(89.54,36.86) 89.66,36.73 v1(89.66,26.44)
FLASH_CS: length 77.8
  Top Layer w0.254: R17.2 66.44,29.49 71.55,29.49 J3.2 86.69,29.95 90.55,33.81 90.55,67.08 82.85,74.79 R8.1
FLASH_MISO: length 29.2
  Top Layer w0.254: v1(77.6,48.67) 75.83,48.67 U2.6 ; v1(78.23,32.41) 78.23,43.72 v1(77.72,44.22) ; J3.3 72.14,27.82 R19.2 78.11,27.82 v1(78.23,27.95)
  Bottom Layer w0.254: v1(77.72,44.22) 77.72,48.54 v1(77.6,48.67) ; v1(78.23,27.95) v1(78.23,32.41)
FLASH_MOSI: length 70.6
  Top Layer w0.254: v1(88.01,22.25) 87.71,21.95 J3.6 ; v1(88.01,34.95) 88.01,64.29 82.42,69.88 R10.1
  Bottom Layer w0.254: v1(88.01,34.95) v1(88.01,22.25)
USER_3V3_IO0: length 105
  Top Layer w0.254: 60.45,6.76 63.12,9.43 63.12,34.44 40.64,56.92 35.31,56.92 20.57,71.66 4.44,71.66 2.92,70.13
USER_3V3_IO1: length 102.2
  Top Layer w0.254: 5.46,70.13 19.81,70.13 35.69,54.26 40.95,54.26 61.98,33.23 v1(61.98,12.98)
  Bottom Layer w0.254: 60.45,4.22 61.72,4.22 61.98,4.47 v1(61.98,12.98)
USER_3V3_IO2: length 69.9
  Top Layer w0.254: 70.94,71.95 66.76,71.95 v1(66.68,72.04) ; v1(13.4,69.12) 4.44,69.12 2.92,67.59
  Bottom Layer w0.254: v1(13.4,69.12) 63.75,69.12 v1(66.68,72.04)
USER_3V3_IO3: length 96.8
  Top Layer w0.254: 5.46,67.59 20.45,67.59 35.18,52.86 40.26,52.86 60.96,32.16 60.96,11.97
  Bottom Layer w0.254: 57.91,6.76 57.91,6.89 60.96,9.93 60.96,11.97
User_3V3_IO3:
  vias: v1(60.96,11.97)
USER_3V3_IO4: length 74.9
  Top Layer w0.254: v1(67.44,73.31) 70.89,73.31 70.94,73.25 ; 2.92,65.05 4.19,66.32 v1(13.05,66.32)
  Bottom Layer w0.254: v1(13.05,66.32) 66.29,66.32 67.44,67.46 v1(67.44,73.31)
USER_3V3_IO5: length 96.4
  Top Layer w0.254: 5.46,65.05 5.72,64.8 20.57,64.8 33.53,51.84 39.62,51.84 59.82,31.65 59.82,12.09 59.18,11.46 59.18,5.49 57.91,4.22
USER_3V3_IO6: length 78.3
  Top Layer w0.254: v1(68.33,74.45) 68.43,74.55 70.94,74.55 ; v1(13.39,63.53) 3.94,63.53 2.79,62.38
  Bottom Layer w0.254: v1(13.39,63.53) 66.17,63.53 68.33,65.69 v1(68.33,74.45)
USER_3V3_IO7: length 91.9
  Top Layer w0.254: 58.29,12.09 58.29,31.78 39.5,50.57 33.02,50.57 21.21,62.38 5.34,62.38
  Bottom Layer w0.254: 55.37,6.76 55.37,8.54 58.29,11.46 58.29,12.09
User_3V3_IO7:
  vias: v1(58.29,12.09)
USER_3V3_IO8: length 95.1
  Top Layer w0.254: 2.92,59.97 4.44,61.5 20.32,61.5 32.51,49.3 39.23,49.3 57.02,31.51 57.02,8.41 56.64,8.03 56.64,5.49 55.37,4.22
USER_3V3_IO9: length 47.6
  Top Layer w0.254: 23.24,55.53 18.8,59.97 5.46,59.97 ; 55.63,31.78 39.05,48.35
  Bottom Layer w0.254: 52.83,6.76 52.83,7.52 55.5,10.19
  vias: v1(55.63,11.97)
User_3V3_IO9: length 40.4
  Top Layer w0.254: 39.05,48.35 31.81,48.35 24.64,55.53 23.24,55.53 ; 55.63,31.78 55.63,11.97
  Bottom Layer w0.254: 55.5,10.19 55.5,11.97
USER_3V3_IO10: length 66.2
  Top Layer w0.254: 2.92,54.89 3.93,55.91 v1(14.6,55.91) ; v1(55.2,51.2) 55.2,52.87 52.29,55.78 v1(51,55.78) ; 62.37,47.91 62.24,47.78 v1(55.25,47.78)
  Bottom Layer w0.254: v1(14.6,55.91) 50.87,55.91 v1(51,55.78) ; v1(55.25,47.78) 55.2,47.83 v1(55.2,51.2)
USER_3V3_IO11: length 86.3
  Top Layer w0.254: 5.46,54.89 5.72,54.72 23.8,54.72 31.24,47.27 38.23,47.27 54.36,31.14 54.36,8.03 54.01,7.68 54.01,5.4 52.83,4.22
USER_3V3_IO12: length 85.7
  Top Layer w0.254: 50.29,6.76 53.21,9.68 53.21,30.58 ; 53.27,30.58 37.47,46.38 30.48,46.38 22.99,53.88 4.44,53.88 2.92,52.35
USER_3V3_IO13: length 83.2
  Top Layer w0.254: 50.29,4.22 49.78,4.22 49.11,4.89 49.11,9.01 51.74,11.64 51.74,29.95 36.96,44.73 30.1,44.73 22.48,52.35 5.46,52.35
USER_3V3_IO14: length 83.4
  Top Layer w0.254: v1(69.01,70.64) 70.36,70.64 ; v1(13.59,51.34) 4.44,51.34 2.92,49.81 ; v1(69.09,64.8) 69.09,58.32 65.41,54.64 v1(63.22,54.64)
  Bottom Layer w0.254: v1(13.59,51.34) 16.89,54.64 v1(63.22,54.64) ; v1(69.09,64.8) 69.01,64.88 v1(69.01,70.64)
USER_3V3_IO15: length 75.5
  Top Layer w0.254: 47.75,6.76 47.75,9.93 49.4,11.58 49.4,28.99 36.07,42.31 28.82,42.33 21.34,49.81 5.46,49.81
USER_3V3_IO16: length 88
  Top Layer w0.254: v1(63.5,62.89) v1(63.5,70.04) ; 2.92,47.27 4.31,48.67 v1(13.84,48.67) ; v1(63.37,75.97) 63.5,75.85 65.2,75.85 65.2,75.85
  Bottom Layer w0.254: v1(63.37,75.97) 62.9,75.5 62.9,70.65 v1(63.5,70.04) ; v1(63.5,62.89) 63.88,62.51 63.88,54.38 63.37,53.88 32.26,53.88 27.05,48.67 v1(13.84,48.67)
USER_3V3_IO17: length 73.7
  Top Layer w0.254: 47.75,4.22 46.57,5.4 46.57,28.51 35.31,39.78 25.27,39.78 17.78,47.27 5.46,47.27
USER_3V3_IO18: length 71.6
  Top Layer w0.254: 45.21,6.76 45.34,6.89 45.34,27.84 34.93,38.25 24.51,38.25 16.76,46 4.19,46 2.92,44.73
USER_3V3_IO19: length 69.7
  Top Layer w0.254: 5.46,44.73 15.75,44.73 23.5,36.98 34.93,36.98 43.94,27.97 43.94,5.49 45.21,4.22
USER_3V3_IO20: length 92.3
  Top Layer w0.254: 2.92,41.99 4.44,43.51 v1(15.83,43.51) ; v1(62.36,52.73) 62.36,58.45 57.55,63.25 57.55,69.56 57.47,69.64 57.47,70.12 57.55,70.2 57.55,71.15 61.59,71.15 62.21,71.76 65.01,71.76 65.2,71.95
  Bottom Layer w0.254: v1(62.36,52.73) 51.56,52.73 47.56,48.73 32.58,48.73 27.36,43.51 v1(15.83,43.51)
USER_3V3_IO21: length 60.4
  Top Layer w0.254: 5.46,41.99 v1(12.95,41.99) ; v1(54.1,50.19) 54.23,50.32 62.37,50.32
  Bottom Layer w0.254: v1(54.1,50.19) 45.9,41.99 v1(12.95,41.99)
USER_3V3_IO22: length 75.9
  Top Layer w0.254: v1(14.61,41.18) 4.44,41.18 2.92,39.65 ; v1(73.91,46) 73.93,46.01 75.77,46.01
  Bottom Layer w0.254: v1(14.61,41.18) 63.25,41.18 66.17,44.1 66.17,44.86 67.13,45.82 73.74,45.82 v1(73.91,46)
USER_3V3_IO23: length 110.4
  Top Layer w0.254: v1(59.44,39.52) 59.56,39.65 59.56,40.41 47.75,52.22 v1(47.75,61.62) ; 65.2,73.25 61.35,73.25 61.34,73.26 61.01,73.26 60.71,73.56 56.64,73.56 56.39,73.31 56.39,61.75 v1(56.26,61.62) ; 5.46,39.65 v1(13.72,39.65)
  Bottom Layer w0.254: v1(59.44,39.52) 13.84,39.52 v1(13.72,39.65) ; v1(47.75,61.62) v1(56.26,61.62)
USER_3V3_IO24: length 110.9
  Top Layer w0.254: v1(67.18,74.58) 67.16,74.55 65.2,74.55
  Bottom Layer w0.254: v1(67.18,74.58) 67.18,75.34 68.38,76.53 73.48,76.53 75.06,74.96 75.06,41.18 72.37,38.48 v1(10.8,38.48)
User_3V3_IO24: length 8.4
  Top Layer w0.254: 2.92,37.11 4.19,38.38 10.8,38.38
USER_3V3_IO25: length 59.8
  Top Layer w0.254: 42.67,6.76 41.22,8.21 41.22,12.09 39.31,14.01 39.31,27.14 32.13,34.32 18.67,34.32 15.88,37.11 5.46,37.11
USER_3V3_IO26: length 63
  Top Layer w0.254: v1(40.64,11.08) 38.1,13.62 38.1,26.95 31.5,33.56 4.66,33.56 3.14,32.03
  Bottom Layer w0.254: 42.67,4.22 41.31,5.58 41.31,7.87 40.64,8.54 v1(40.64,11.08)
USER_3V3_IO27: length 55
  Top Layer w0.254: v1(39.17,11.21) 36.83,13.55 36.83,27.21 32,32.03 5.68,32.03
  Bottom Layer w0.254: v1(39.17,11.21) 39.88,10.5 39.88,7.01 40.13,6.76
USER_3V3_IO28: length 147.5
  Top Layer w0.254: 2.92,29.49 4.44,31.02 v1(25.02,31.02) 31.75,31.02 35.69,27.08 35.69,13.04 41.4,7.32 41.4,4.98 40.64,4.22 40.13,4.22
  Bottom Layer w0.254: v1(25.02,31.02) 60.83,31.02 66.42,36.6 71.88,36.6 90.3,55.02 90.3,64.16 91.69,65.56 91.82,65.56
User_3V3_IO28: length 9.4
  Top Layer w0.254: v1(91.69,65.69) 91.69,68.19 J6.3
USER_3V3_IO29: length 143.1
  Top Layer w0.254: 37.59,4.22 38.77,5.4 38.77,7.99 34.54,12.22 34.54,26.93 31.99,29.49 v1(23.97,29.49) 5.46,29.49
  Bottom Layer w0.254: v1(23.97,29.49) 61.47,29.49 67.05,35.08 72.14,35.08 91.82,54.76 91.82,57.52 96.7,62.4
USER_3V3_IO30: length 53.5
  Top Layer w0.254: 2.92,26.95 4.44,28.48 31.56,28.48 33.53,26.51 33.53,10.82 37.59,6.76
USER_3V3_IO31: length 47.4
  Top Layer w0.254: 35.05,6.76 32.51,9.3 32.51,25.37 30.93,26.95 5.46,26.95
USER_3V3_IO32: length 48.9
  Top Layer w0.254: v1(31.55,9.93) 31.62,10.01 31.62,24.83 30.51,25.94 4.44,25.94 2.92,24.41
  Bottom Layer w0.254: v1(31.55,9.93) 31.55,9.73 29.59,7.77 29.59,7.14 29.97,6.76
USER_3V3_IO33: length 43.2
  Top Layer w0.254: 5.46,24.41 29.88,24.41 30.61,23.69 30.61,8.66 32.51,6.76
USER_3V3_IO34: length 150.5
  Top Layer w0.254: 2.92,21.87 4.44,23.4 v1(22.46,23.4) 28.45,23.4 29.85,22 29.85,9.99 v1(29.9,9.93)
  Bottom Layer w0.254: v1(22.46,23.4) 65.12,23.4 65.12,29.46 68.89,33.23 82.99,33.23 93.22,43.46 93.22,48.67 96.05,51.5 96.65,51.5 ; 35.05,4.22 35.36,3.91 35.36,2.75 34.8,2.19 28.19,2.19 27.69,2.69 27.69,7.72 v1(29.9,9.93)
USER_3V3_IO35: length 127.9
  Top Layer w0.254: 29.01,9.22 29.01,20.55 27.69,21.87 5.46,21.87 ; 32.26,2.69 32.51,2.95 32.51,4.22
  Bottom Layer w0.254: 96.65,40.33 96.65,25.68 87.76,16.79 69.98,16.79 65.02,21.75 v1(26.16,21.75)
User_3V3_IO35: length 11
  Top Layer w0.254: 29.01,9.22 27.69,7.9 27.69,3.84 28.83,2.69 32.26,2.69
$1N39: length 2.6
  Top Layer w0.254: 18.3,15.65 3V3.1
$1N100: length 5
  Top Layer w0.254: R3.1 62.25,71.3 65.2,71.3
$1N110: length 6.2
  Top Layer w0.254: U2.16 69.97,47.91 R12.1
$1N121: length 6.6
  Top Layer w0.254: R13.1 65.41,50.32 66.46,49.26 U2.14
$1N148: length 6.7
  Top Layer w0.254: R11.1 65.79,45.37 67.08,46.66 U2.18
$1N153: length 5.5
  Top Layer w0.254: U1.5 76.07,72.6 R9.2
$1N155: length 4.7
  Top Layer w0.254: R5.1 62.65,74.79 63.54,73.9 65.2,73.9
$1N157: length 5.4
  Top Layer w0.254: R6.1 60.82,77.06 62.75,75.14 65.14,75.14 65.2,75.2
$1N159: length 4.4
  Top Layer w0.254: R4.1 60.88,72.6 65.2,72.6
$1N162: length 6
  Top Layer w0.254: R7.2 76.08,76.74 74.04,76.74 72.51,75.2 U1.9
$1N164: length 5.8
  Top Layer w0.254: U1.7 73.75,73.9 74.68,74.83 76.29,74.83 R8.2
$1N165: length 6
  Top Layer w0.254: U1.3 74.91,71.3 R10.2
$1N253: length 3
  Top Layer w0.254: 5V.1 R20.1

## Copper pours and planes (outline as drawn; the poured copper is in the pictures)
3V3 on Top Layer: 50.36,96.37 51.94,97.94 52.83,97.94 53.34,97.44 53.34,93.76 53.68,93.42 55.44,93.42 55.88,93.86 55.88,97.44 56.26,97.82 58.04,97.82 58.55,97.31 58.55,91.59 57.91,90.96 51.82,90.96 50.36,92.41
3V3 on Top Layer: 25.36,94.93 30.1,95.02 30.61,94.52 30.61,84.74 30.22,84.35 25.78,84.35 25.78,91.69 25.17,92.3 25.17,94.75
GND on Top Layer: -33.27,111.79 138.05,111.79 138.05,-20.29 -33.27,-20.29
GND on Bottom Layer: -20.7,107.85 125.86,107.85 125.86,-4.67 -20.7,-4.67

## Text on the board
Top Silkscreen Layer: 5V | 3V3 | IO34 | IO0 | IO35 | IO1 | GND | PWR | BUSY | RST | DC | CS | CLK | DIN | IO33 | IO31 | IO30 | IO29 | IO27 | IO28 | IO25 | IO26 | IO18 | IO19 | IO15 | IO17 | IO12 | IO13 | IO9 | IO11 | IO7 | IO8 | IO3 | IO5 | MOSI | MISO | IDC-40Pin | 2*13Pin | IO32 | 1 | 接上跳线帽关闭缓存 | 一般不需要接跳线帽 | Flash模块 | 墨水屏
